# Altium schematic sheet PowerUnit.SchDoc
size A4; SheetNumber: 1; SheetTotal: 4
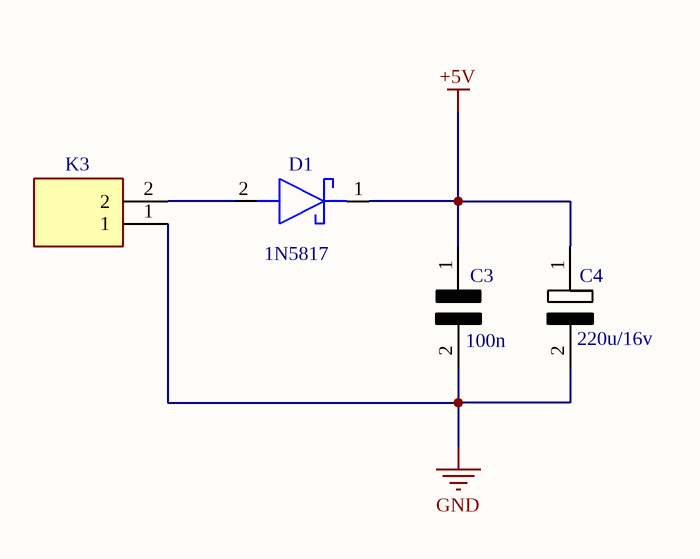
[diagram p0: PowerUnit.SchDoc]

## Parts
C3  100n  [C0805]
C4  220u/16v  [C0805]
D1  1N5817  [1n5817_footprint]
K3  Con2Polig  [OSTTE020104]  (value not drawn)

## Nets
+5V: C3.1 C4.1 D1.1(K)
GND: C3.2 C4.2 K3.1
NetD1_2: D1.2(A) K3.2

## Library data of the parts
C3 = KeramischeC0805_1: 0805 ceramic capacitor; Manufacturer_Name: Murata Electronics; Manufacturer_Part_Number: GRM188R71H103KA01D; Datasheet Link: https://datasheet.datasheetarchive.com/originals/distributors/Datasheets_SAMA/ec4f1577dddcc7a13ddad897a28002d3.pdf; Height: 0.9mm; Mouser Part Number: 81-GRM39X103K50D; Mouser Price/Stock: https://www.mouser.co.uk/ProductDetail/Murata-Electronics/GRM188R71H103KA01D?qs=WWniysbtxULrL2ljbViAbw%3D%3D; Arrow Part Number: GRM188R71H103KA01D; Arrow Price/Stock: https://www.arrow.com/en/products/grm188r71h103ka01d/murata-manufacturing?region=europe
C4 = elektrolytischeC0805: 0805 ceramic capacitor; Manufacturer_Name: Murata Electronics; Manufacturer_Part_Number: GRM188R71H103KA01D; Datasheet Link: https://datasheet.datasheetarchive.com/originals/distributors/Datasheets_SAMA/ec4f1577dddcc7a13ddad897a28002d3.pdf; Height: 0.9mm; Mouser Part Number: 81-GRM39X103K50D; Mouser Price/Stock: https://www.mouser.co.uk/ProductDetail/Murata-Electronics/GRM188R71H103KA01D?qs=WWniysbtxULrL2ljbViAbw%3D%3D; Arrow Part Number: GRM188R71H103KA01D; Arrow Price/Stock: https://www.arrow.com/en/products/grm188r71h103ka01d/murata-manufacturing?region=europe
D1 = 1N5817: Schottky Diode; Manufacturer_Name: Rectron; Datasheet Link: https://www.arrow.com/en/products/1n5817/rectron; Manufacturer_Part_Number: 1N5817; Arrow Part Number: 1N5817; Arrow Price/Stock: https://www.arrow.com/en/products/1n5817/rectron?region=nac
K3 = Con2Polig: Connector; Manufacturer_Name: On Shore Technology Inc.; Datasheet Link: https://datasheet.datasheetarchive.com/originals/dk/DKDS-18/336634.pdf; Height: 8.7mm; Manufacturer_Part_Number: OSTTE020104